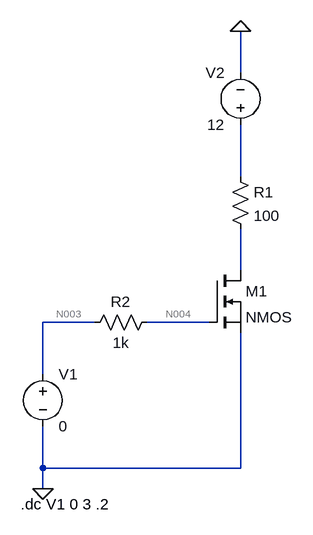
[diagram p0: schematic 2_1_1.asc]
2_1_1.asc, the LTspice schematic file:
Version 4
SHEET 1 880 680
WIRE 48 -176 48 -240
WIRE 48 -16 48 -96
WIRE 48 128 48 64
WIRE -176 208 -256 208
WIRE 0 208 -96 208
WIRE -256 288 -256 208
WIRE -256 432 -256 368
WIRE 48 432 48 224
WIRE 48 432 -256 432
WIRE -256 464 -256 432
FLAG -256 464 0
FLAG 48 -240 0
SYMBOL nmos 0 128 R0
SYMATTR InstName M1
SYMBOL res 32 -32 R0
SYMATTR InstName R1
SYMATTR Value 100
SYMBOL res -80 192 R90
WINDOW 0 0 56 VBottom 2
WINDOW 3 32 56 VTop 2
SYMATTR InstName R2
SYMATTR Value 1k
SYMBOL voltage -256 272 R0
WINDOW 123 0 0 Left 0
WINDOW 39 0 0 Left 0
SYMATTR InstName V1
SYMATTR Value 0
SYMBOL voltage 48 -80 R180
WINDOW 0 24 96 Left 2
WINDOW 3 24 16 Left 2
WINDOW 123 0 0 Left 0
WINDOW 39 0 0 Left 0
SYMATTR InstName V2
SYMATTR Value 12
TEXT -290 488 Left 2 !.dc V1 0 3 .2

The netlist it stands for:
* 2_1_1.asc
M1 N002 N004 0 0 NMOS
R1 N001 N002 100
R2 N004 N003 1k
V1 N003 0 0
V2 N001 0 12
.model NMOS NMOS
.model PMOS PMOS
.lib standard.mos
.dc V1 0 3 .2
.backanno
.end

* Results of the author's LTspice run, read from the files saved beside the schematic
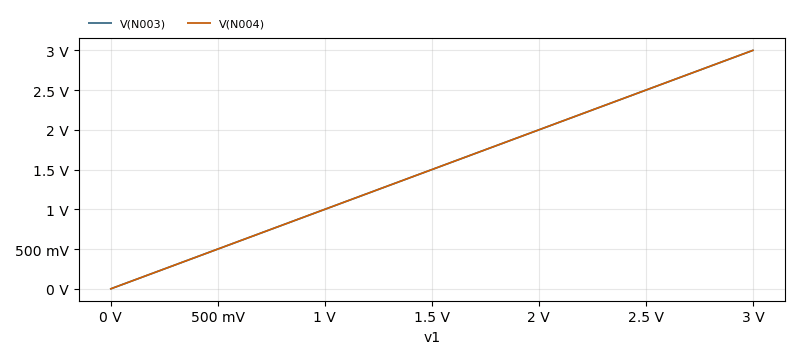
[diagram p1: DC transfer characteristic of 2_1_1.asc, plotted from the saved traces]
* DC transfer characteristic, 1 run:
*   V(N003): 0 V at v1=0 V, 3 V at v1=3 V, min 0 V, max 3 V
*   V(N004): 0 V at v1=0 V, 3 V at v1=3 V, min 0 V, max 3 V